# Altium schematic sheet DECODER.SchDoc
size A4
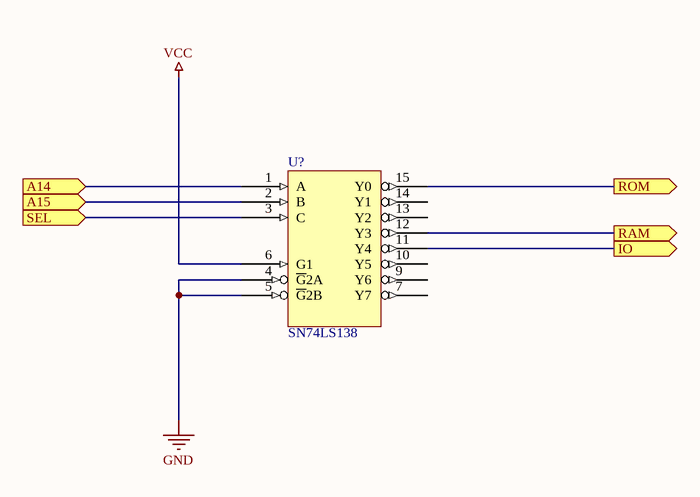
[diagram p0: DECODER.SchDoc]

## Parts
U?  SN74LS138  [SOIC16]

## Ports
A14 (in), A15 (in), IO (out), RAM (out), ROM (out), SEL (in)

## Nets
GND: U?.4(~{G}2A) U?.5(~{G}2B) U?.8(GND)
VCC: U?.6(G1) U?.16(VCC)
A14: U?.1(A) ; port A14
A15: U?.2(B) ; port A15
IO: U?.11(Y4) ; port IO
RAM: U?.12(Y3) ; port RAM
ROM: U?.15(Y0) ; port ROM
SEL: U?.3(C) ; port SEL

Not connected (* = marked no-connect by the designer): U? 7(Y7) 9(Y6) 10(Y5) 13(Y2) 14(Y1)